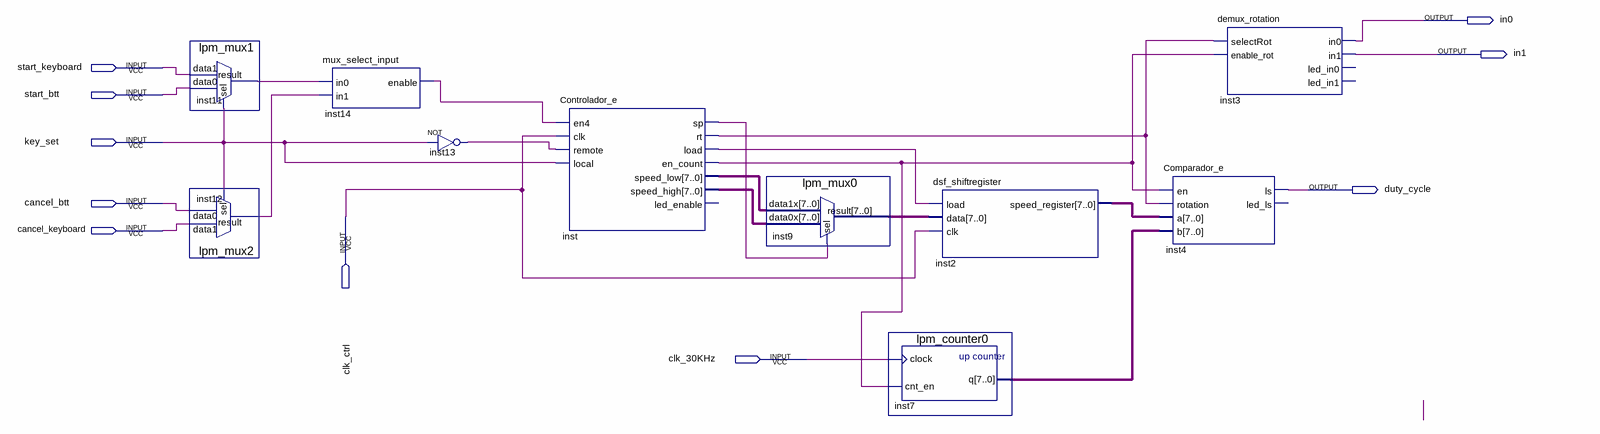
[diagram p0: schematic sheet]
// Quartus schematic motor.bdf as structural Verilog: 10 symbols, 10 pins
module motor (
  input  start_keyboard,
  input  start_btt,
  input  key_set,
  input  cancel_btt,
  input  clk_ctrl,
  input  cancel_keyboard,
  input  clk_30KHz,
  output in0,
  output in1,
  output duty_cycle
);

  wire inst11_result, inst12_result, inst13_out, inst14_enable, inst_en_count, inst_load, inst_rt, inst_sp;
  wire [7:0] inst2_speed_register, inst7_q, inst9_result, inst_speed_high, inst_speed_low;

  lpm_mux1 inst11 (.data1(start_keyboard), .data0(start_btt), .sel(key_set), .result(inst11_result));
  lpm_mux2 inst12 (.data1(cancel_keyboard), .data0(cancel_btt), .sel(key_set), .result(inst12_result));
  mux_select_input inst14 (.in0(inst11_result), .in1(inst12_result), .enable(inst14_enable));
  not inst13 (inst13_out, key_set);
  Controlador_e inst (
    .en4(inst14_enable), .clk(clk_ctrl), .remote(inst13_out), .\local (key_set), .sp(inst_sp), .rt(inst_rt),
    .load(inst_load), .en_count(inst_en_count), .speed_low(inst_speed_low), .speed_high(inst_speed_high));  // open: led_enable
  lpm_mux0 inst9 (.data1x(inst_speed_low), .data0x(inst_speed_high), .sel(inst_sp), .result(inst9_result));
  lpm_counter0 inst7 (.clock(clk_30KHz), .cnt_en(inst_en_count), .q(inst7_q));
  dsf_shiftregister inst2 (
    .load(inst_load), .data(inst9_result), .clk(clk_ctrl), .speed_register(inst2_speed_register));
  Comparador_e inst4 (
    .en(inst_en_count), .rotation(inst_rt), .a(inst2_speed_register), .b(inst7_q), .ls(duty_cycle));  // open: led_ls
  demux_rotation inst3 (
    .selectRot(inst_rt), .enable_rot(inst_en_count), .in0(in0), .in1(in1));  // open: led_in0, led_in1
endmodule
